# EAGLE design jaluino_bee (EAGLE 5.11)
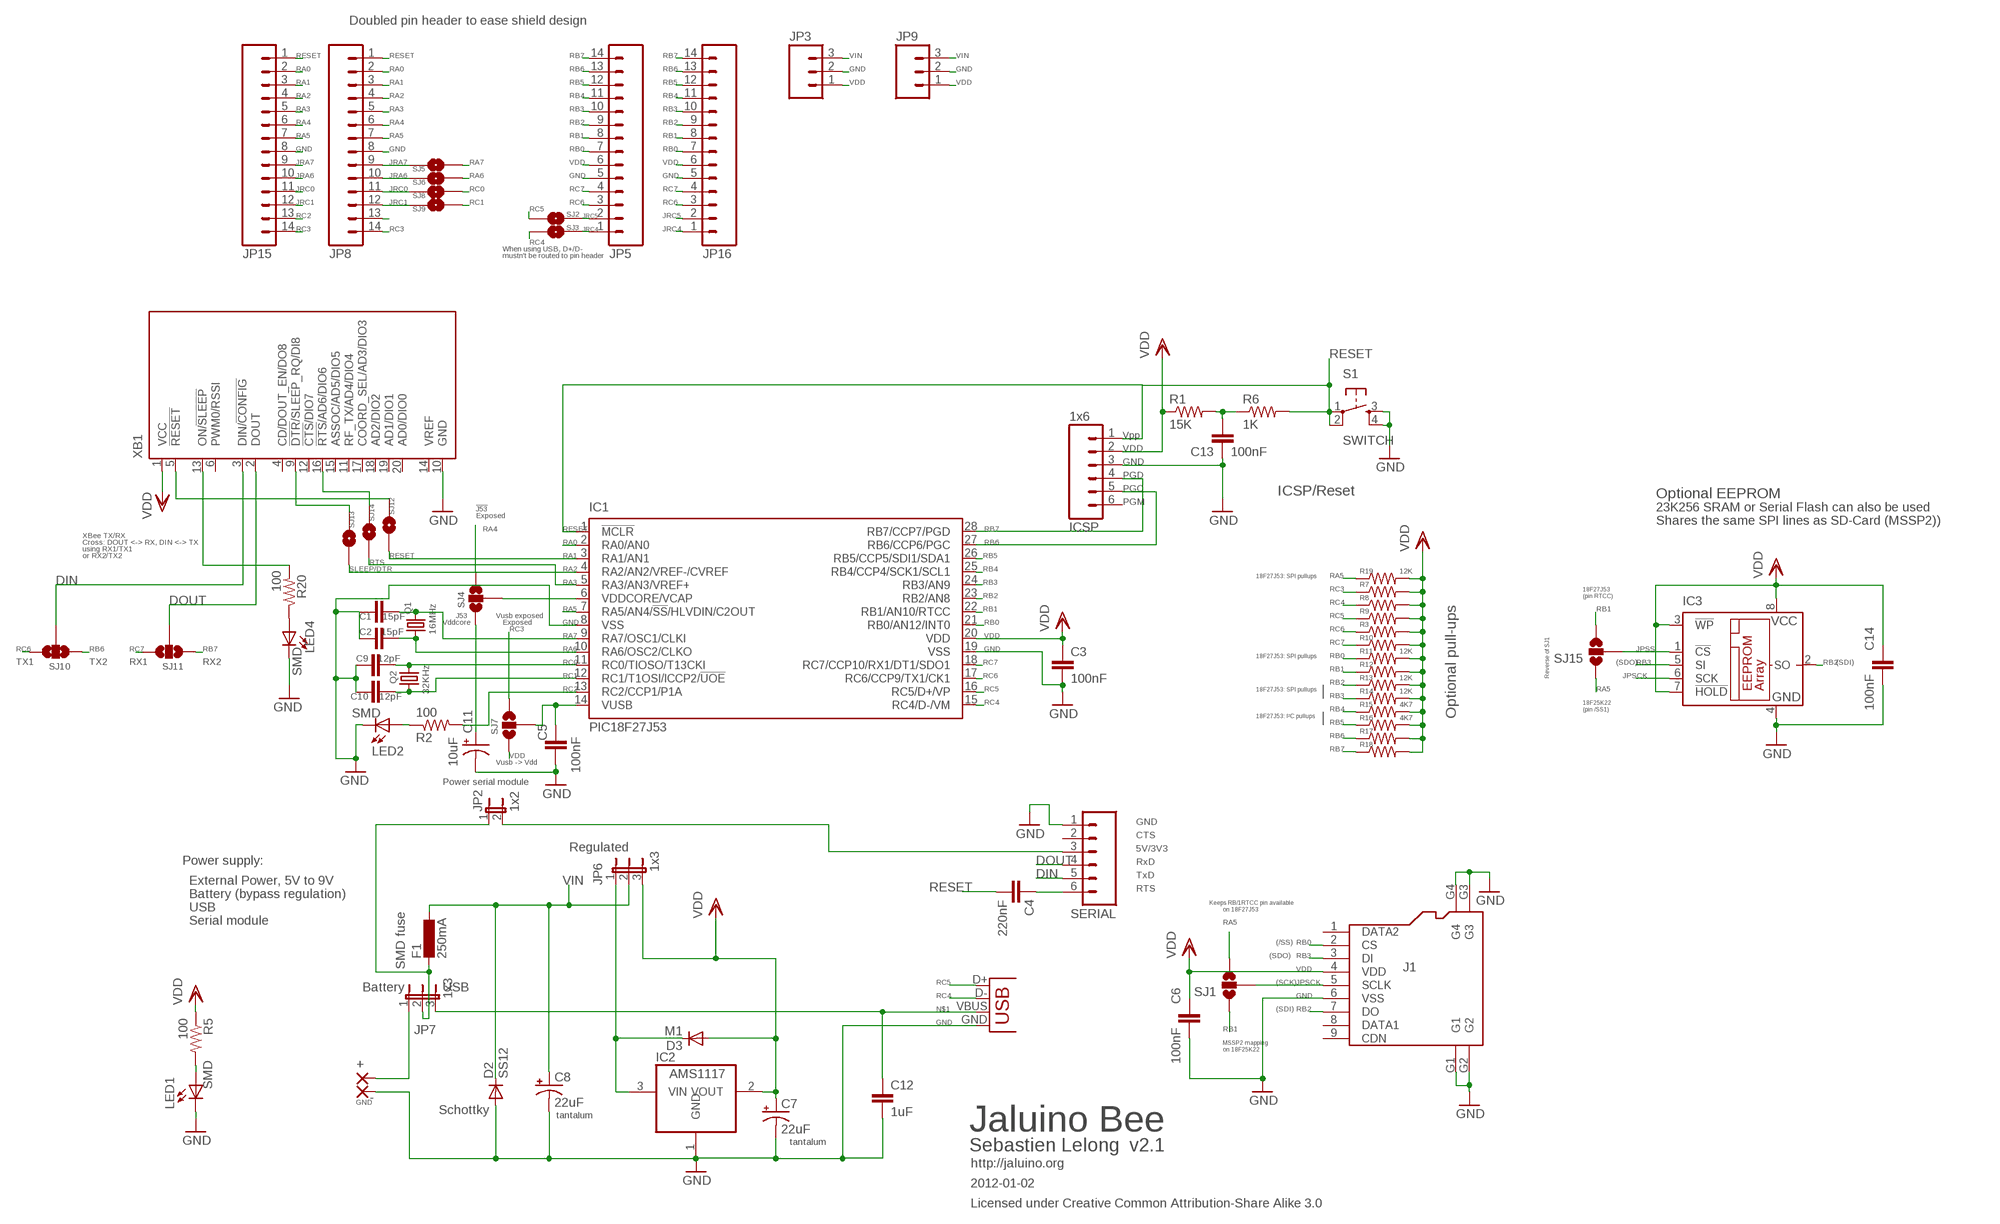
[diagram p0: schematic, sheet 1]

## Parts
+  2,54/1,0  [2,54/1,0]
-  2,54/1,0  [2,54/1,0]
C1  15pF  CAP1206  [1206]
C2  15pF  CAP1206  [1206]
C3  100nF  CAP1206  [1206]
C4  220nF  CAP1206  [1206]
C5  100nF  CAP1206  [1206]
C6  100nF  CAP1206  [1206]
C7  22uF  CAP_POL3528  [EIA3528]
C8  22uF  CAP_POL3528  [EIA3528]
C9  12pF  CAP1206  [1206]
C10  12pF  CAP1206  [1206]
C11  10uF  CAP_POL3528  [EIA3528]
C12  1uF  CAP1206  [1206]
C13  100nF  CAP1206  [1206]
C14  100nF  CAP1206  [1206]
D2  SS12  DIODESMA  [SMA-DIODE]
D3  M1  DIODE-DO-214AC  [DO-214AC]
F1  250mA  L-EUL1812  [L1812]
IC1  PIC18F27J53  PIC18F2455_28W  [SO28W]
IC2  AMS1117  REG1117  [SOT223]
IC3  25LC080SN  [SO-08]
ICSP  1x6  M06SIP  [1X06]
J1  HOLDER-MICROSD-9P  [9P-SMD-W/-RING]
JP2  1x2  JUMPER-2PTH  [1X02]
JP3  M03PTH  [1X03]
JP5  M14  [1X14]
JP6  1x3  JP2E  [JP2]
JP7  1x3  JP2E  [JP2]
JP8  M14  [1X14]
JP9  M03PTH  [1X03]
JP15  M14  [1X14]
JP16  M14  [1X14]
LED1  SMD  LED1206  [LED-1206]
LED2  SMD  LED1206  [LED-1206]
LED4  SMD  LED1206  [LED-1206]
Q1  16MHz  CRYSTALHC49S  [HC49/S]
Q2  32KHz  CRYSTALTC26H  [TC26H]
R1  15K  RESISTOR1206  [1206]
R2  100  RESISTOR1206  [1206]
R3  RESISTOR1206  [1206]
R5  100  RESISTOR1206  [1206]
R6  1K  RESISTOR1206  [1206]
R7  RESISTOR1206  [1206]
R8  RESISTOR1206  [1206]
R9  RESISTOR1206  [1206]
R10  RESISTOR1206  [1206]
R11  12K  RESISTOR1206  [1206]
R12  RESISTOR1206  [1206]
R13  12K  RESISTOR1206  [1206]
R14  12K  RESISTOR1206  [1206]
R15  4K7  RESISTOR1206  [1206]
R16  4K7  RESISTOR1206  [1206]
R17  RESISTOR1206  [1206]
R18  RESISTOR1206  [1206]
R19  12K  RESISTOR1206  [1206]
R20  100  RESISTOR1206  [1206]
S1  SWITCH  TAC_SWITCHSMD  [TACTILE_SWITCH_SMD]
SERIAL  M06SIP  [1X06]
SJ1  SOLDERJUMPER_2WAYS  [SJ_3]
SJ2  SOLDERJUMPERNO  [SJ_2S-NO]
SJ3  SOLDERJUMPERNO  [SJ_2S-NO]
SJ4  SOLDERJUMPER_2WAYS  [SJ_3]
SJ5  SOLDERJUMPERNO  [SJ_2S-NO]
SJ6  SOLDERJUMPERNO  [SJ_2S-NO]
SJ7  SOLDERJUMPER_2WAYS  [SJ_3]
SJ8  SOLDERJUMPERNO  [SJ_2S-NO]
SJ9  SOLDERJUMPERNO  [SJ_2S-NO]
SJ10  SOLDERJUMPER_2WAYS  [SJ_3]
SJ11  SOLDERJUMPER_2WAYS  [SJ_3]
SJ12  SOLDERJUMPERNO  [SJ_2S-NO]
SJ13  SOLDERJUMPERNO  [SJ_2S-NO]
SJ14  SOLDERJUMPERNO  [SJ_2S-NO]
SJ15  SOLDERJUMPER_2WAYS  [SJ_3]
X2  USB-MICROB  [USB-MICROB]
XB1  XBEE  [XBEE]

## Nets
DIN: SERIAL.5 SJ10.2 XB1.3(DIN/!CONFIG)
DOUT: SERIAL.4 SJ11.2 XB1.2(DOUT)
GND: -.1(P) C1.1 C2.1 C3.2 C5.2 C6.2 C7.C(-) C8.C(-) C9.1 C10.1 C11.C(-) C12.2 C13.2 C14.2 D2.A IC1.8(VSS) IC1.19(VSS) IC2.1(GND) IC3.4(GND) ICSP.3 J1.6(VSS) J1.G1 J1.G2 J1.G3 J1.G4 JP3.2 JP5.5 JP8.8 JP9.2 JP15.8 JP16.5 LED1.C LED2.C LED4.C S1.3 S1.4 SERIAL.1 X2.GND XB1.10(GND)
JPSCK: IC3.6(SCK) J1.5(SCLK) SJ1.2
JPSS: IC3.1(!CS) SJ15.2
JRA6: JP8.10 JP15.10 SJ6.2
JRA7: JP8.9 JP15.9 SJ5.2
JRC0: JP8.11 JP15.11 SJ8.2
JRC1: JP8.12 JP15.12 SJ9.2
JRC4: JP5.1 JP16.1 SJ3.2
JRC5: JP5.2 JP16.2 SJ2.2
N$1: C12.1 JP7.3 X2.VBUS
N$2: C4.1 SERIAL.6
N$3: IC1.6(VDDCORE/VCAP) SJ4.2
N$4: F1.2 JP2.1 JP7.2
N$5: C13.1 R1.2 R6.1
N$6: LED1.A R5.2
N$7: LED2.A R2.1
N$8: C11.A(+) SJ4.1
N$9: JP2.2 SERIAL.3
N$10: D3.C IC2.3(VIN) JP6.1
N$11: SJ12.2 XB1.5(!RESET)
N$12: C5.1 IC1.14(VUSB) SJ7.2
N$13: SJ13.2 XB1.9(!DTR!/SLEEP_RQ/DI8)
N$15: LED4.A R20.1
N$16: R20.2 XB1.13(ON/!SLEEP)
N$17: SJ14.2 XB1.16(!RTS!/AD6/DIO6)
RA0: IC1.2(RA0/AN0) JP8.2 JP15.2
RA1: IC1.3(RA1/AN1) JP8.3 JP15.3 SJ12.1
RA2: IC1.4(RA2/AN2/VREF-/CVREF) JP8.4 JP15.4 SJ13.1
RA3: IC1.5(RA3/AN3/VREF+) JP8.5 JP15.5 SJ14.1
RA4: JP8.6 JP15.6 SJ4.3
RA5: IC1.7(RA5/AN4/!SS!/HLVDIN/C2OUT) JP8.7 JP15.7 R19.1 SJ1.3 SJ15.1
RA6: C2.2 IC1.10(RA6/OSC2/CLKO) Q1.1 SJ6.1
RA7: C1.2 IC1.9(RA7/OSC1/CLKI) Q1.2 SJ5.1
RB0: IC1.21(RB0/AN12/INT0) J1.2(CS) JP5.7 JP16.7 R11.1
RB1: IC1.22(RB1/AN10/RTCC) JP5.8 JP16.8 R12.1 SJ1.1 SJ15.3
RB2: IC1.23(RB2/AN8) IC3.2(SO) J1.7(DO) JP5.9 JP16.9 R13.1
RB3: IC1.24(RB3/AN9) IC3.5(SI) J1.3(DI) JP5.10 JP16.10 R14.1
RB4: IC1.25(RB4/CCP4/SCK1/SCL1) JP5.11 JP16.11 R15.1
RB5: IC1.26(RB5/CCP5/SDI1/SDA1) JP5.12 JP16.12 R16.1
RB6: IC1.27(RB6/CCP6/PGC) ICSP.5 JP5.13 JP16.13 R17.1 SJ10.1
RB7: IC1.28(RB7/CCP7/PGD) ICSP.4 JP5.14 JP16.14 R18.1 SJ11.1
RC0: C9.2 IC1.11(RC0/TIOSO/T13CKI) Q2.2 SJ8.1
RC1: C10.2 IC1.12(RC1/T1OSI/ICCP2/!UOE) Q2.1 SJ9.1
RC2: IC1.13(RC2/CCP1/P1A) JP8.13 JP15.13 R2.2
RC3: JP8.14 JP15.14 R7.1 SJ7.3
RC4: IC1.15(RC4/D-/VM) R8.1 SJ3.1 X2.D-
RC5: IC1.16(RC5/D+/VP) R9.1 SJ2.1 X2.D+
RC6: IC1.17(RC6/CCP9/TX1/CK1) JP5.3 JP16.3 R3.1 SJ10.3
RC7: IC1.18(RC7/CCP10/RX1/DT1/SDO1) JP5.4 JP16.4 R10.1 SJ11.3
RESET: C4.2 IC1.1(!MCLR!) ICSP.1 JP8.1 JP15.1 R6.2 S1.1 S1.2
VDD: C3.1 C6.1 C7.A(+) C14.1 D3.A IC1.20(VDD) IC2.2(VOUT) IC3.3(!WP) IC3.7(!HOLD) IC3.8(VCC) ICSP.2 J1.4(VDD) JP3.1 JP5.6 JP6.3 JP9.1 JP16.6 R1.1 R3.2 R5.1 R7.2 R8.2 R9.2 R10.2 R11.2 R12.2 R13.2 R14.2 R15.2 R16.2 R17.2 R18.2 R19.2 SJ7.1 XB1.1(VCC)
VIN: +.1(P) C8.A(+) D2.C F1.1 JP3.3 JP6.2 JP7.1 JP9.3
Unconnected: ICSP.6 J1.1(DATA2) J1.8(DATA1) J1.9(CDN) SERIAL.2 XB1.4(CD/DOUT_EN/DO8) XB1.6(PWM0/RSSI) XB1.11(RF_TX/AD4/DIO4) XB1.12(!CTS!/DIO7) XB1.14(VREF) XB1.15(ASSOC/AD5/DIO5) XB1.17(COORD_SEL/AD3/DIO3) XB1.18(AD2/DIO2) XB1.19(AD1/DIO1) XB1.20(AD0/DIO0)

## Notes on the sheet
- Doubled pin header to ease shield design
- When using USB, D+/D-
- mustn't be routed to pin header
- Vpp
- VDD
- GND
- PGD
- PGC
- ICSP/Reset | Optional EEPROM
- PGM
- !J53 | 23K256 SRAM or Serial Flash can also be used
- Exposed
- Shares the same SPI lines as SD-Card (MSSP2))
- XBee TX/RX
- Cross: DOUT <-> RX, DIN <-> TX
- using RX1/TX1
- or RX2/TX2 | RESET
- RTS
- SLEEP/DTR
- 18F27J53: SPI pullups
- 18F27J53
- (pin RTCC)
- J53 | Vusb exposed
- Vddcore | Exposed
- 18F27J53: SPI pullups
- TX1 | TX2 | RX1 | RX2 | (SDO) | (SDI)
- Reverse of SJ1
- 18F27J53: SPI pullups
- 18F25K22
- (pin /SS1)
- 18F27J53: I²C pullups | Optional pull-ups
- Vusb -> Vdd
- Power serial module
- GND
- CTS
- Regulated | 5V/3V3
- Power supply: | RxD
- TxD
- External Power, 5V to 9V
- RTS
- Battery (bypass regulation)
- Keeps RB/1RTCC pin available
- USB | SMD fuse | on 18F27J53
- Serial module
- (/SS)
- (SDO)
- (SCK)
- Battery | USB
- (SDI)
- MSSP2 mapping
- on 18F25K22
- GND | Schottky
- tantalum
- Jaluino Bee
- tantalum
- Sebastien Lelong | v2.1
- http://jaluino.org
- 2012-01-02
- Licensed under Creative Common Attribution-Share Alike 3.0

## Library data of the parts
+ - = wirepad:2,54/1,0: THROUGH-HOLE PAD
C1-C6 C9 C10 C12-C14 = SparkFun:CAP: Capacitor Standard 0603 ceramic capacitor, and 0.1" leaded capacitor.
C7 C8 C11 = SparkFun:CAP_POL: Capacitor Polarized These are standard SMD and PTH capacitors. Normally 10uF, 47uF, and 100uF in electrolytic and tantalum varieties. Always verify the external diameter of the through hole cap, it varies with capacity, voltage, and manufacturer. The EIA devices should be standard.
D2 = SparkFun:DIODE: Diode These are standard reverse protection diodes and small signal diodes. SMA package can handle up to about 1A. SOD-323 can handle about 200mA. What the SOD-323 package when ordering, there are some mfgs out there that are 5-pin packages.
D3 = diode:DIODE-: DIODE
F1 = rcl:L-EU: INDUCTOR, European symbol
IC1 = microchip:PIC18F2*_28: USB Microcontrollers with nanoWatt Technology High-Performance, Enhanced Flash, 28/40/44-Pin, Source: http://ww1.microchip.com/downloads/en/devicedoc/39632c.pdf
IC2 = burr-brown:REG1117: 800mA and 1A Low Dropout (LDO) Positive Regulator 1.8V, 2.5V, 2.85V, 3.3V, 5V, and Adj
IC3 = microchip:25*: Serial EEPROM 4 K, SPI bus
ICSP SERIAL = SparkFun:M06: Header 6 Standard 6-pin 0.1" header. Use with straight break away headers (SKU : PRT-00116), right angle break away headers (PRT-00553), swiss pins (PRT-00743), machine pins (PRT-00117), and female headers (PRT-00115). Molex polarized connector foot print use with SKU : PRT-08094 with associated crimp pins and housings. NOTES ON THE VARIANTS LOCK and LOCK_LONGPADS... This footprint was designed to help hold the alignment of a through-hole component (i.e. 6-pin header) while soldering it into place. You may notice that each hole has been shifted either up or down by 0.005 of an inch from it's more standard position (which is a perfectly straight line). This slight alteration caused the pins (the squares in the middle) to touch the edges of the holes. Because they are alternating, it causes a "brace" to hold the component in place. 0.005 has proven to be the perfect amount of "off-center" position when using our standard breakaway headers. Although looks a little odd when you look at the bare footprint, once you have a header in there, the alteration is very hard to notice. Also, if you push a header all the way into place, it is covered up entirely on the bottom side. This idea of altering the position of holes to aid alignment will be further integrated into the Sparkfun Library for other footprints. It can help hold any component with 3 or more connection pins.
J1 = Connector:HOLDER-MICROSD-9P
JP2 = SparkFun:JUMPER-2: Jumper Basic 0.1" spaced jumper. Use with breakaway headers.
JP3 JP9 = SparkFun:M03: Header 3 Standard 3-pin 0.1" header. Use with straight break away headers (SKU : PRT-00116), right angle break away headers (PRT-00553), swiss pins (PRT-00743), machine pins (PRT-00117), and female headers (PRT-00115). Molex polarized connector foot print use with SKU : PRT-08232 with associated crimp pins and housings.
JP5 JP8 JP15 JP16 = SparkFun:M14: Header 14 Standard 14-pin 0.1" header. Use with straight break away headers (SKU : PRT-00116), right angle break away headers (PRT-00553), swiss pins (PRT-00743), machine pins (PRT-00117), and female headers (PRT-00115).
JP6 JP7 = jumper:JP2E: JUMPER
LED1 LED2 LED4 = SparkFun:LED: LEDs Standard schematic elements and footprints for 5mm, 3mm, 1206, and 0603 sized LEDs. 5mm - Spark Fun Electronics SKU : COM-00529 (and others)
Q1 Q2 = crystal:CRYSTAL: CRYSTAL
R1-R3 R5-R20 = SparkFun:RESISTOR: Resistor Basic schematic elements and footprints for 0603, 1206, and PTH resistors.
S1 = SparkFun:TAC_SWITCH: Momentary Switch Button commonly used for reset or general input. Spark Fun Electronics SKU : COM-00097
SJ1 SJ4 SJ7 SJ10 SJ11 SJ15 = SparkFun:SOLDERJUMPER_2WAY: Solder Jumper 2 way solder jumper
SJ2 SJ3 SJ5 SJ6 SJ8 SJ9 SJ12-SJ14 = SparkFun:SOLDERJUMPER: Solder Jumper Standard SMD solder jumper. Used to automate production. Two varients : Normally Open and Normally Closed are the same, but have different paste layers. NC will have a large amount of paste and should jumper during reflow.
X2 = SparkFun:USB: USB Connectors USB-B-PTH is fully proven SKU : PRT-00139 USB-miniB is fully proven SKU : PRT-00587 USB-A-PCB is untested. USB-A-H is throughly reviewed, but untested. Spark Fun Electronics SKU : PRT-00437 USB-B-SMT is throughly reviewed, but untested. Needs silkscreen touching up. USB-A-S has not been used/tested USB-MB-H has not been used/tested
XB1 = maxstream:XBEE: XBee (TM) /XBee-PRO(TM) OEM RF Modules Source: MaxStream, Inc. xbee_productmanual.pdf

## Board
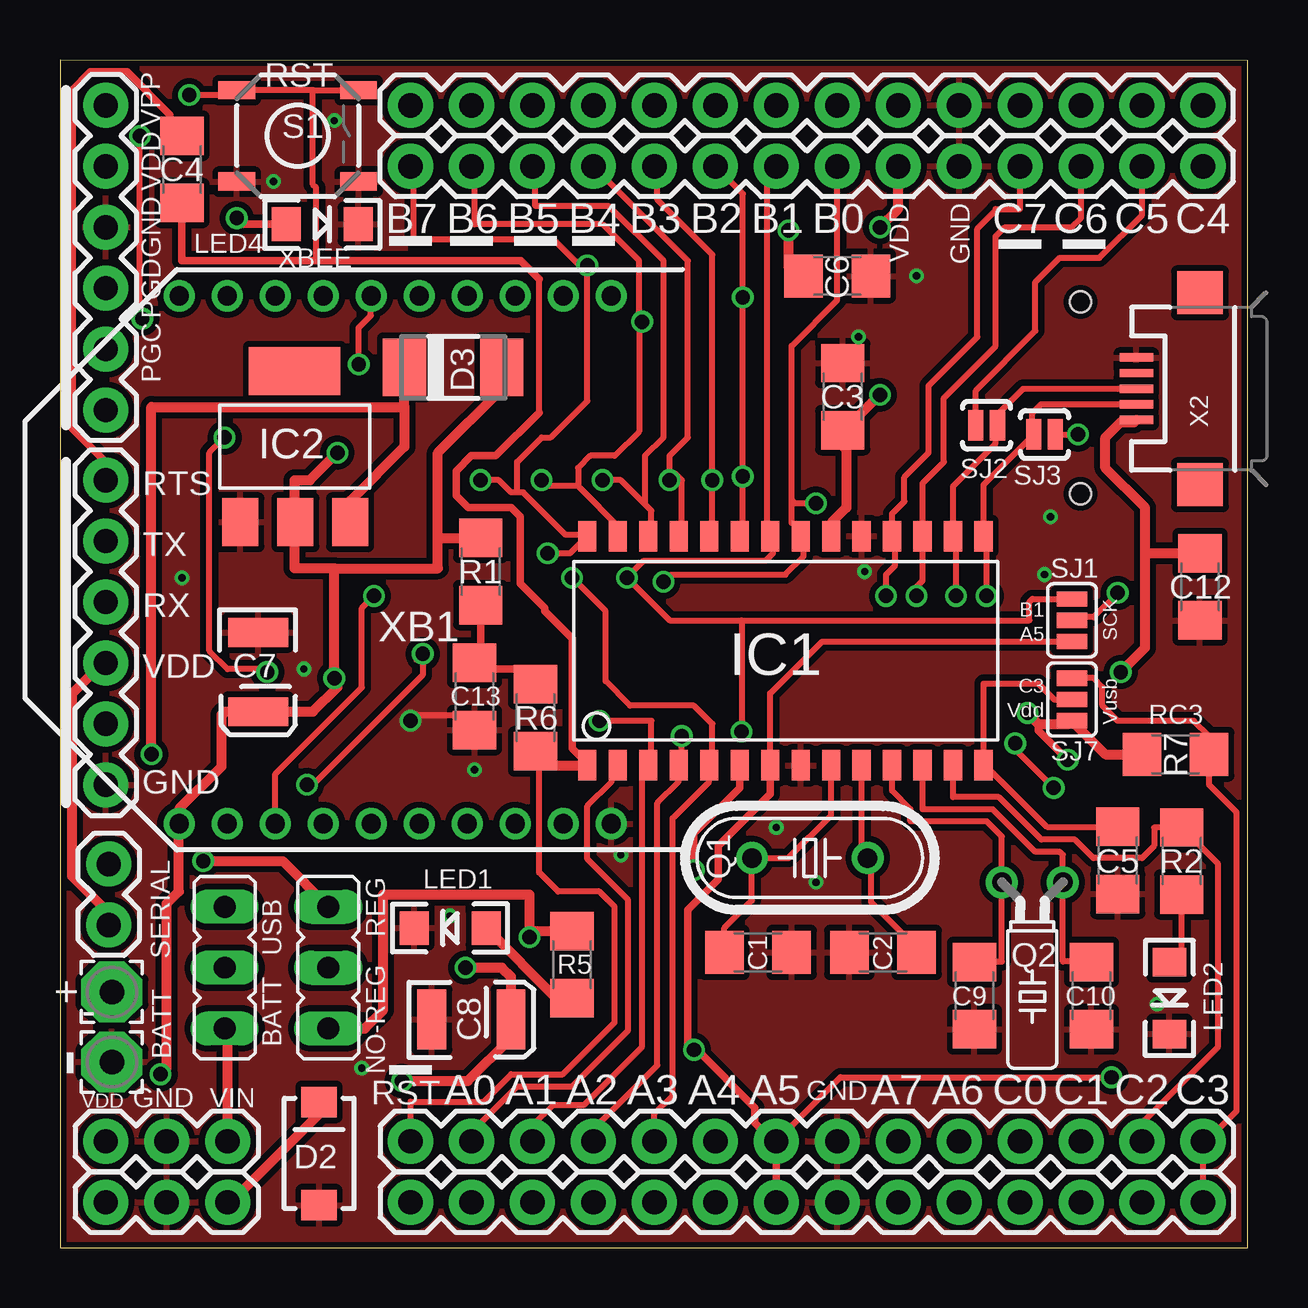
[diagram p1: board, top side]
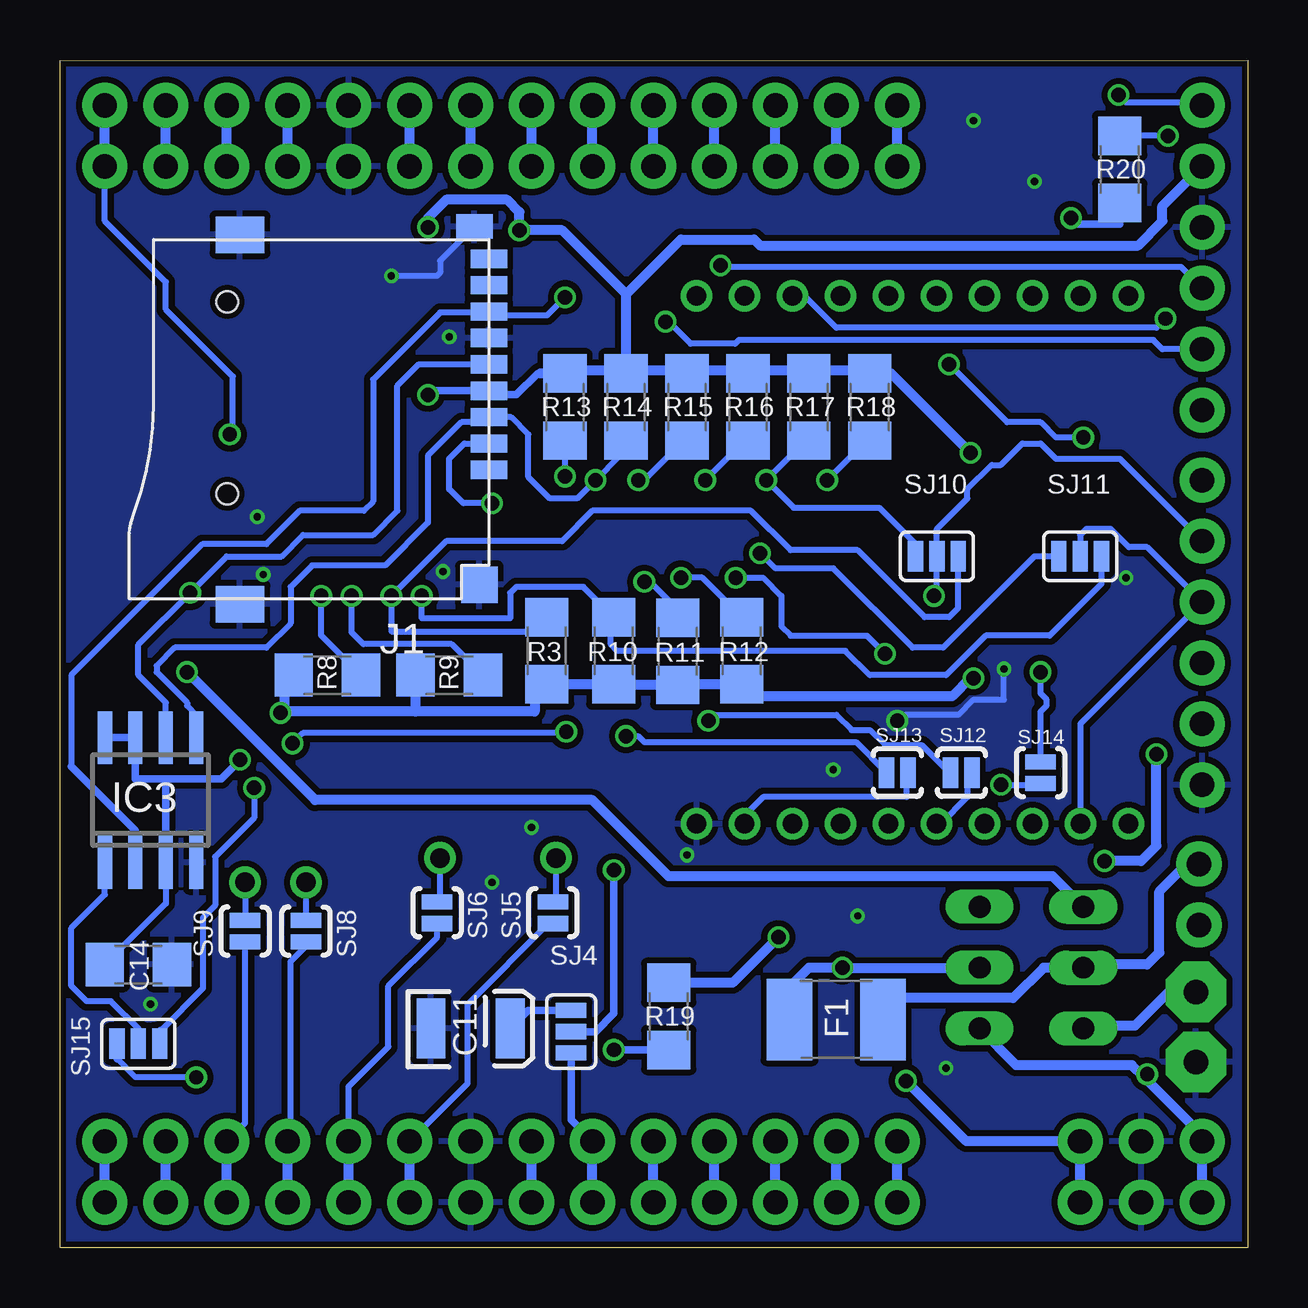
[diagram p2: board, bottom side, seen from below]

Size 49.49 x 49.52 mm. Coordinates in mm from the lower left corner, seen from the top.
Outline: 0,0 49.49,0 49.49,49.49 0,49.52 0,0
Copper layers (1*16): Top 0.035mm / dielectric 1.5mm / Bottom 0.035mm
Design rules "bee_seeed": minimum track width 6mil, minimum drill 12mil, track to track 6mil, track to pad 6mil, pad to pad 6mil, via to via 6mil, smd to smd 0mil, copper to edge 10mil, drill to drill 10mil, minimum pad ring 10mil, minimum via ring 6mil, stop-mask expansion 2mil, vias tented up to drill 100mil, thermal gap 10mil

### Footprints (pad centres in the part's own frame; a part is rotated, then mirrored left to right if it is on the bottom)
2,54/1,0 = drill 1.016 pad 2.54 octagon: 1 0,0
1206 = smd 1.6 x 1.8: 1 -1.4,0; 2 1.4,0
EIA3528 = smd 1.2 x 2.5: A 1.65,0; C -1.65,0
SMA-DIODE = smd 1.27 x 1.47: A -2.15,0; C 2.15,0
DO-214AC = smd 1.8 x 2.4: A 2.025,0; C -2.025,0
L1812 = smd 1.9 x 3.4: 1 -1.95,0; 2 1.95,0
SO28W = smd 0.762 x 1.27: 1 -7.62,-4.78; 2 -6.35,-4.78; 3 -5.08,-4.78; 4 -3.81,-4.78; 5 -2.54,-4.78; 6 -1.27,-4.78; 7 0,-4.78; 8 1.27,-4.78; 9 2.54,-4.78; 10 3.81,-4.78; 11 5.08,-4.78; 12 6.35,-4.78; 13 7.62,-4.78; 14 8.89,-4.78; 15 8.89,4.78; 16 7.62,4.78; 17 6.35,4.78; 18 5.08,4.78; 19 3.81,4.78; 20 2.54,4.78; 21 1.27,4.78; 22 0,4.78; 23 -1.27,4.78; 24 -2.54,4.78; 25 -3.81,4.78; 26 -5.08,4.78; 27 -6.35,4.78; 28 -7.62,4.78
SOT223 = smd 1.499 x 2.007: 1 -2.261,-3.15; 2 0.025,-3.15; 3 2.311,-3.15 | smd 3.81 x 2.007: 4 0,3.15
SO-08 = smd 0.6 x 2.2: 1 -1.905,-2.6; 2 -0.635,-2.6; 3 0.635,-2.6; 4 1.905,-2.6; 5 1.905,2.6; 6 0.635,2.6; 7 -0.635,2.6; 8 -1.905,2.6
1X06 = drill 1.016 pad 1.88 round: 1 0,0; 2 2.54,0; 3 5.08,0; 4 7.62,0; 5 10.16,0; 6 12.7,0
9P-SMD-W/-RING = smd 1.524 x 0.762: 1 0,4.4; 2 0,3.3; 3 0,2.2; 4 0,1.1; 5 0,0; 6 0,-1.1; 7 0,-2.2; 8 0,-3.3; 9 0,-4.4 | smd 1.524 x 1.016: G1 0.6,-5.746 | smd 2.032 x 1.524: G2 10.373,-5.4; G3 10.373,10 | smd 1.524 x 1.524: G4 0.392,9.181 | hole 0.889: 10.9,-2.6; 10.9,5.4
1X02 = drill 1.016 pad 1.88 round: 1 0,0; 2 2.54,0
1X03 = drill 1.016 pad 1.88 round: 1 0,0; 2 2.54,0; 3 5.08,0
1X14 = drill 1.016 pad 1.88 round: 1 0,0; 2 2.54,0; 3 5.08,0; 4 7.62,0; 5 10.16,0; 6 12.7,0; 7 15.24,0; 8 17.78,0; 9 20.32,0; 10 22.86,0; 11 25.4,0; 12 27.94,0; 13 30.48,0; 14 33.02,0
JP2 = drill 0.914 long: 1 -2.54,0; 2 0,0; 3 2.54,0
LED-1206 = smd 1.2 x 1.4: A -1.5,0; C 1.5,0
HC49/S = drill 0.813 round: 1 -2.413,0; 2 2.413,0
TC26H = drill 0.813 round: 1 -1.27,0; 2 1.27,0
TACTILE_SWITCH_SMD = smd 1.524 x 0.762: 1 -2.54,1.905; 2 2.54,1.905; 3 -2.54,-1.905; 4 2.54,-1.905
SJ_3 = smd 0.635 x 1.27: 1 -0.889,0; 2 0,0; 3 0.889,0
SJ_2S-NO = smd 0.635 x 1.27: 1 -0.45,0; 2 0.45,0
USB-MICROB = smd 0.35 x 1.4: D+ 0,2.65; D- -0.65,2.65; GND 1.3,2.65; ID 0.65,2.65; VBUS -1.3,2.65 | smd 1.8 x 1.9: MT1 -4,0; MT2 4,0
XBEE = drill 0.8 pad 1.27 round: 1 -11,9; 2 -11,7; 3 -11,5; 4 -11,3; 5 -11,1; 6 -11,-1; 7 -11,-3; 8 -11,-5; 9 -11,-7; 10 -11,-9; 11 11,-9; 12 11,-7; 13 11,-5; 14 11,-3; 15 11,-1; 16 11,1; 17 11,3; 18 11,5; 19 11,7; 20 11,9

### Placement (x,y rotation side)
+  2.16,10.67 0 top
-  2.16,7.75 0 top
C1  29.08,12.32 180 top
C2  34.29,12.32 0 top
C3  32.61,35.48 90 top
C4  5.08,44.96 270 top
C5  44.07,16.15 270 top
C6  32.38,40.51 0 top
C7  8.26,24 270 top
C8  17.14,9.53 0 top
C9  38.1,10.52 90 top
C10  42.98,10.52 90 top
C11  32.38,9.14 0 bottom
C12  47.5,27.56 270 top
C13  17.27,22.99 270 top
C14  46.23,11.81 0 bottom
D2  10.79,3.94 90 top
D3  16.38,36.7 0 top
F1  17.14,9.53 0 bottom
IC1  29.59,24.89 0 top
IC2  9.78,33.4 0 top
IC3  45.72,18.67 0 bottom
ICSP  1.91,47.62 270 top
J1  31.62,36.83 180 bottom
JP2  2.03,16 270 top
JP3  1.91,1.91 0 top
JP5  47.62,45.09 180 top
JP6  11.18,11.68 270 top
JP7  6.86,11.68 90 top
JP8  14.61,1.91 0 top
JP9  1.91,4.45 0 top
JP15  14.61,4.45 0 top
JP16  47.62,47.62 180 top
LED1  16.26,13.34 180 top
LED2  46.23,10.41 270 top
LED4  10.92,42.67 0 top
Q1  31.24,16.26 180 top
Q2  40.51,15.24 180 top
R1  17.53,28.19 270 top
R2  46.74,16.13 90 top
R3  29.21,24.89 270 bottom
R5  21.34,11.81 270 top
R6  19.81,22.1 270 top
R7  46.48,20.57 180 top
R8  38.35,23.88 180 bottom
R9  33.27,23.88 180 bottom
R10  26.42,24.89 270 bottom
R11  23.75,24.87 270 bottom
R12  21.08,24.89 270 bottom
R13  28.45,35.05 90 bottom
R14  25.91,35.05 90 bottom
R15  23.37,35.05 90 bottom
R16  20.83,35.05 90 bottom
R17  18.29,35.05 90 bottom
R18  15.75,35.05 90 bottom
R19  24.13,9.65 90 bottom
R20  5.33,44.96 90 bottom
S1  9.91,46.35 0 top
SERIAL  1.91,19.3 90 top
SJ1  42.16,26.16 270 top
SJ2  38.61,34.29 180 top
SJ3  41.02,33.91 0 top
SJ4  28.19,9.02 270 bottom
SJ5  28.96,13.97 270 bottom
SJ6  33.78,13.97 270 bottom
SJ7  42.16,22.86 90 top
SJ8  39.24,13.21 270 bottom
SJ9  41.78,13.21 270 bottom
SJ10  12.95,28.83 0 bottom
SJ11  6.99,28.83 0 bottom
SJ12  11.94,19.81 0 bottom
SJ13  14.61,19.81 0 bottom
SJ14  8.64,19.81 90 bottom
SJ15  46.23,8.51 0 bottom
X2  47.5,35.81 90 top
XB1  13.97,28.68 90 top

### Tracks (layer width: path | path; a pad name or v marks a point on that pad's centre or on a via)
DIN  (via drill 0.6)
  Top 0.254: v13.08,27.18 12.57,26.67 12.57,23.37 8.97,19.77 XB1.3
  Bottom 0.254: SERIAL.5 5.33,32.89 8,32.89 8.64,33.53 9.4,33.53 10.29,32.64 10.67,32.64 11.68,31.62 11.68,31.24 12.95,29.97 SJ10.2 12.95,27.3 v13.08,27.18
DOUT
  Bottom 0.254: SJ11.2 6.99,29.72 6.73,29.97 5.71,29.97 4.95,29.21 4.19,29.21 SERIAL.4 6.97,21.86 XB1.2
GND  (via drill 0.3, 0.6)
  Top 0.254: v14.61,21.97 14.86,22.23 16.63,22.23 C13.2
  Bottom 0.254: v10.16,24.13 10.16,22.86 11.43,22.86 12.06,22.23 14.35,22.23 v14.61,21.97 | J1.G1 33.66,41.15 33.66,40.64 C6.2 v35.69,40.51
  other vias: 41.27,30.48 8.89,44.45 45.72,10.16 11.43,46.99 41.02,28.07 33.53,28.19 33.27,37.97 31.5,15.24 23.37,16.38 16.26,13.84 12.57,7.49 5.08,27.94 17.27,19.94 29.84,17.53
  pour Top (isolate 0.254): 0,49.53 49.53,49.53 49.53,0 0,0
  pour Bottom (isolate 0.254): 0,49.53 49.53,49.53 49.53,0 0,0
JPSCK  (via drill 0.6)
  Top 0.254: SJ1.2 42.29,26.29 43.05,26.29 v44.07,27.3
  Bottom 0.254: IC3.6 45.09,22.73 46.23,23.88 46.23,25.15 v44.07,27.3 42.55,28.83 40.26,28.83 39.37,29.72 36.45,29.72 35.43,30.73 35.43,35.94 34.54,36.83 J1.5
JPSS
  Bottom 0.254: SJ15.2 46.23,9.14 47.37,10.29 48.39,10.29 49.02,10.92 49.02,13.34 47.62,14.73 IC3.1
JRA6
  Bottom 0.254: JP8.10 37.47,6.73 35.81,8.38 35.81,10.92 33.78,12.95 SJ6.2
  Bottom 0.406: JP8.10 JP15.10
JRA7
  Bottom 0.254: SJ5.2 29.15,13.52 32.51,10.16 32.51,6.86 JP15.9
  Bottom 0.406: JP8.9 JP15.9
JRC0
  Bottom 0.254: SJ8.2 39.24,12.57 39.88,11.94 39.88,4.57 JP15.11
  Bottom 0.406: JP8.11 JP15.11
JRC1
  Bottom 0.254: SJ9.2 41.78,5.21 JP15.12
  Bottom 0.406: JP8.12 JP15.12
JRC4  (via drill 0.6)
  Top 0.254: SJ3.2 v42.42,33.91
  Bottom 0.254: JP5.1 47.62,42.8 45.09,40.26 45.09,39.12 42.29,36.32 42.29,34.04 v42.42,33.91
  Bottom 0.406: JP5.1 JP16.1
JRC5
  Top 0.254: SJ2.2 38.16,35.74 40.64,38.23 40.64,40.26 41.66,41.27 43.31,41.27 45.09,43.05 JP5.2
  Bottom 0.406: JP5.2 JP16.2
N$1  (via drill 0.6)
  Top 0.406: v44.2,24 45.21,25.02 45.21,28.96 | 45.21,28.96 45.21,30.86 43.56,32.51 43.56,33.78 44.2,34.42 44.75,34.42 X2.VBUS | 45.21,28.96 C12.1
  Bottom 0.406: JP7.3 8.13,15.49 24.13,15.49 27.3,18.67 38.86,18.67 v44.2,24
N$2
  Top 0.305: SERIAL.6 1.91,32.77 0.51,34.16 0.51,48.26 1.27,49.02 2.79,49.02 4.57,47.24 4.57,46.23 5.33,46.23 C4.1
N$3  (via drill 0.6)
  Top 0.305: IC1.6 28.32,19.18 26.42,17.27 v26.42,15.75
  Bottom 0.305: v26.42,15.75 26.42,9.78 27.18,9.02 SJ4.2
N$4
  Bottom 0.406: JP2.1 2.54,16 3.68,14.86 3.68,12.32 4.19,11.81 6.73,11.81 JP7.2 8.51,11.68 9.78,10.41 14.31,10.41 F1.2
N$5
  Top 0.305: R6.1 19.81,23.62 19.3,24.13 17.53,24.13 C13.1 17.53,24.64 R1.2
N$6
  Top 0.406: R5.2 20.68,10.41 LED1.A
N$7
  Top 0.254: R2.1 46.74,11.94 46.23,11.94 LED2.A
N$8
  Bottom 0.305: SJ4.1 29.97,9.91 C11.A
N$9
  Top 0.406: JP2.2 2.03,13.97 0.51,15.49 0.51,23.11 1.78,24.38 SERIAL.3
N$10  (via drill 0.6)
  Top 0.406: 12.06,31.11 12.06,30.35 IC2.3 12.09,31.14 14.35,33.4 14.35,35.05 | v3.81,20.57 3.81,35.05 14.35,35.05 | v5.97,16.13 9.27,16.13 JP6.1 | 14.35,35.05 D3.C
  Bottom 0.406: v3.81,20.57 3.81,16.76 4.45,16.13 v5.97,16.13
N$11
  Bottom 0.254: SJ12.2 11.68,19.62 11.68,18.8 12.8,17.68 XB1.5
N$12
  Top 0.254: SJ7.2 41.43,22.86 40.77,23.52 38.48,23.52 IC1.14 38.56,20.11 41.12,17.55 C5.1
N$13
  Bottom 0.254: SJ13.2 14.22,19.74 14.22,18.8 20.19,18.8 20.97,18.02 XB1.9
N$15  (via drill 0.6)
  Top 0.305: v7.37,42.93 7.62,42.67 LED4.A
  Bottom 0.305: v7.37,42.93 7.11,42.67 5.33,42.67 R20.1
N$16  (via drill 0.6)
  Top 0.254: v3.43,38.73 3.33,38.84 v3.33,46.35 3.43,46.35 3.45,46.33
  Bottom 0.254: v3.33,46.35 R20.2 | v3.43,38.73 3.81,38.35 17.14,38.35 18.41,39.62 18.91,39.62 XB1.13
N$17  (via drill 0.6)
  Top 0.254: v12.45,36.83 12.45,38.35 12.95,38.86 12.95,39.67 XB1.16 | v8.64,24 8.51,24.13 6.99,24.13 6.22,24.89 6.22,33.15 v6.86,33.78
  Bottom 0.254: v12.45,36.83 10.03,34.42 8.64,34.42 8,33.78 v6.86,33.78 | v8.64,24 8.64,23.11 8.38,22.86 8.38,22.61 8.64,22.35 SJ14.2
RA0
  Top 0.254: JP15.2 17.14,4.83 19.05,6.73 21.34,6.73 23.67,9.07 23.67,14.5 21.97,16.2 21.97,18.41 22.99,19.43 22.99,19.86 23.24,19.86 IC1.2
  Bottom 0.406: JP8.2 JP15.2
RA1  (via drill 0.6)
  Top 0.254: JP15.3 19.68,5.08 20.57,5.97 21.84,5.97 24.26,8.38 24.26,19.6 24.51,19.6 IC1.3 24.64,20.32 24.64,21.97 v22.48,21.97
  Bottom 0.254: v22.48,21.97 22.23,22.23 17.14,22.23 16.51,21.59 15.75,21.59 15.11,20.95 13.59,20.95 12.45,19.81 SJ12.1
  Bottom 0.406: JP8.3 JP15.3
RA2  (via drill 0.6)
  Top 0.254: JP15.4 22.23,4.95 24.89,7.62 24.89,18.54 25.78,19.43 IC1.4 25.91,20.32 v25.91,21.34
  Bottom 0.254: v25.91,21.34 25.4,21.34 25.15,21.08 16.32,21.08 SJ13.1
  Bottom 0.406: JP8.4 JP15.4
RA3  (via drill 0.6)
  Top 0.254: JP15.5 24.77,5.59 25.53,6.35 25.53,17.91 27.05,19.43 IC1.5 27.18,20.32 27.18,21.84 26.42,22.61 23.75,22.61 22.73,23.62 22.73,26.54 v21.34,27.94 | 14.86,24.51 v15.11,24.77 15.11,23.88 10.54,19.3 v10.29,19.3
  Bottom 0.254: v21.34,27.94 20.19,27.94 19.43,27.18 19.43,25.91 19.05,25.53 15.88,25.53 v15.11,24.77 | SJ14.1 8.69,19.3 v10.29,19.3
  Bottom 0.406: JP8.5 JP15.5
RA4
  Bottom 0.305: SJ4.3 28.19,5.33 JP15.6
  Bottom 0.406: JP8.6 JP15.6
RA5  (via drill 0.6)
  Top 0.254: IC1.7 29.59,23.11 31.75,25.27 SJ1.3 | v43.81,7.11 32.51,7.11 JP15.7
  Top 0.305: IC1.7 29.59,18.92 27.43,16.76 27.43,15.37 26.16,14.1 26.16,8.51 v26.42,8.26 26.54,8.26 28.96,5.84 28.96,5.21 29.84,4.32 JP8.7
  Bottom 0.254: v43.81,7.11 46.35,7.11 47.12,7.87
  Bottom 0.305: v26.42,8.26 R19.1 | 47.12,7.87 SJ15.1
  Bottom 0.406: JP8.7 JP15.7
RA6
  Top 0.254: IC1.10 33.4,16.51 Q1.1 33.78,16.13 SJ6.1 35.69,12.51 C2.2
  Bottom 0.254: Q1.1 33.66,14.55 SJ6.1
RA7
  Top 0.254: IC1.9 32.13,18.03 30.35,16.26 Q1.2 28.83,14.48 27.68,13.33 C1.2
  Bottom 0.254: Q1.2 28.83,14.55 SJ5.1
RB0  (via drill 0.6)
  Top 0.254: JP5.7 32.38,39.5 30.48,37.59 30.48,31.17 | v25.15,27.76 25.45,28.07 30.23,28.07 30.99,28.83 30.99,29.46 IC1.21 30.99,29.72 30.48,30.23 30.48,31.17 | 30.48,31.17 30.61,31.04 v31.5,31.04
  Bottom 0.254: R11.1 23.75,26.62 24.89,27.76 v25.15,27.76 | v31.5,31.04 32.69,31.04 33.27,31.62 33.27,32.89 32.64,33.53 J1.2
  Bottom 0.406: JP5.7 JP16.7
RB1  (via drill 0.6)
  Top 0.254: JP5.8 29.46,44.7 29.46,29.72 IC1.22 29.72,29.46 29.72,28.96 29.41,28.65 24.33,28.65 v23.62,27.94 25.4,26.16 28.4,26.16 | SJ1.1 40.51,27.05 40.39,26.92 40.39,26.16 28.4,26.16 | v41.4,19.18 39.8,20.78 v39.8,21.03 | 28.4,26.16 v28.4,21.51
  Bottom 0.254: v39.8,21.03 39.37,21.46 28.45,21.46 v28.4,21.51 | v41.4,19.18 41.4,17.93 43.03,16.31 43.03,14.28 43.54,13.77 43.54,10.82 45.26,9.09 45.31,9.09 45.36,9.04 45.36,8.59 SJ15.3 | v23.62,27.94 22.73,27.94 R12.1
  Bottom 0.406: JP5.8 JP16.8
RB2  (via drill 0.6)
  Top 0.254: IC1.23 28.45,29.72 v28.45,32.16 v28.45,39.62 28.45,43.94 JP5.9
  Bottom 0.254: v28.45,32.16 R13.1 | v28.45,39.62 29.21,38.86 31.45,38.86 J1.7 31.66,38.99 33.66,38.99 36.45,36.2 36.45,31.11 36.83,30.73 39.5,30.73 40.89,29.34 43.56,29.34 49.02,23.88 49.02,20.07
  Bottom 0.305: 49.02,20.07 46.35,17.4 IC3.2
  Bottom 0.406: JP5.9 JP16.9
RB3  (via drill 0.6)
  Top 0.254: IC1.24 27.18,29.72 v27.18,32 27.18,41.4 24.89,43.69 24.89,44.96 JP5.10
  Bottom 0.254: R14.1 25.91,33.53 26.16,33.53 26.16,33.02 v27.18,32 27.94,31.24 29.08,31.24 29.97,32.13 29.97,33.91 30.69,34.63 J1.3 31.62,34.42 32.77,34.42 34.16,33.02 34.16,30.23 35.94,28.45 38.99,28.45 39.88,27.56 39.88,26.04 40.89,25.02 44.7,25.02 45.47,24.26 45.47,24 44.2,22.73 44.2,22.61 43.81,22.23 | 43.81,22.23 IC3.5 | 43.81,22.23 43.69,22.23
  Bottom 0.406: JP5.10 JP16.10
RB4  (via drill 0.6)
  Top 0.254: 25.91,32 25.91,29.72 IC1.25 | 25.91,32 v25.4,32 25.4,33.02 26.16,33.78 26.16,41.15 JP5.11 | 25.91,32 25.65,32.26
  Bottom 0.254: v25.4,32 25.15,32 23.62,33.53 23.37,33.53 R15.1
  Bottom 0.406: JP5.11 JP16.11
RB5  (via drill 0.6)
  Top 0.254: 24.38,30.99 24.64,30.73 24.64,29.72 IC1.26 | 24.38,30.99 23.37,32 v22.61,32 | JP5.12 19.81,44.96 19.81,43.43 22.86,43.43 25.15,41.15 25.15,33.78 24.38,33.02 24.38,30.99
  Bottom 0.254: v22.61,32 21.08,33.53 20.83,33.53 R16.1
  Bottom 0.406: JP5.12 JP16.12
RB6  (via drill 0.6)
  Top 0.254: 21.59,31.75 23.37,29.97 23.37,29.72 IC1.27 | 21.59,31.75 20.07,31.75 v20.07,32 | JP5.13 17.27,44.96 17.27,42.67 22.61,42.67 24.13,41.15 24.13,38.61 | 24.13,38.61 24.13,34.04 23.11,33.02 22.1,33.02 21.59,32.51 21.59,31.75 | v24.26,38.61 24.13,38.61
  Bottom 0.254: R17.1 18.29,33.53 18.54,33.53 v20.07,32 18.92,30.86 15.37,30.86 13.84,29.34 SJ10.1 | ICSP.5 3.56,37.47 3.94,37.85 21.21,37.85 21.36,37.69 23.22,37.69 24.13,38.61 v24.26,38.61
  Bottom 0.406: JP5.13 JP16.13
RB7  (via drill 0.6)
  Top 0.254: 19.05,31.5 18.8,31.5 18.29,32 v17.53,32 | 19.05,31.5 19.3,31.5 21.08,29.72 21.84,29.72 IC1.28 21.25,28.96 v20.32,28.96 | JP5.14 14.73,44.96 14.73,42.04 20.57,42.04 21.97,40.64 v21.97,40.96 21.97,35.31 20.45,33.78 20.07,33.78 19.05,32.77 19.05,31.5
  Bottom 0.254: v17.53,32 16,33.53 15.75,33.53 R18.1 | v21.97,40.96 21.97,40.89 2.79,40.89 ICSP.4 | SJ11.1 8.89,28.83 12.7,25.02 13.97,25.02 17.27,28.32 19.68,28.32 v20.32,28.96
  Bottom 0.406: JP5.14 JP16.14
RC0
  Top 0.254: IC1.11 34.67,19.05 35.43,18.29 35.43,17.78 38.61,17.78 39.24,17.14 Q2.2 39.24,11.94 38.1,11.94 C9.2
  Bottom 0.254: Q2.2 SJ8.1
RC1
  Top 0.254: IC1.12 35.94,18.29 38.86,18.29 40.64,16.51 41.66,16.51 41.78,16.38 Q2.1 41.78,11.94 42.93,11.94 C10.2
  Bottom 0.254: Q2.1 SJ9.1
RC2
  Top 0.254: IC1.13 37.21,18.8 39.12,18.8 40.89,17.02 42.29,17.02 43.05,16.26 45.09,16.26 45.59,16.76 45.59,17.53 R2.2 48.26,16 48.26,8.38 45.09,5.21 JP15.13
  Bottom 0.406: JP8.13 JP15.13
RC3
  Top 0.254: JP8.14 47.62,4.32 49.02,5.71 49.02,18.16 47.88,19.3 R7.1 | R7.1 47.88,21.34 47.24,21.97 44.07,21.97 43.43,22.61 43.43,23.37 43.05,23.75 SJ7.3 | R7.1
  Bottom 0.406: JP8.14 JP15.14
RC4  (via drill 0.6)
  Top 0.254: v38.61,27.18 38.61,29.46 IC1.15 38.48,31.82 SJ3.1 40.51,33.97 40.51,34.8 40.88,35.16 X2.D-
  Bottom 0.254: R8.1 38.61,25.53 v38.61,27.18
RC5  (via drill 0.6)
  Top 0.254: IC1.16 37.08,29.34 | IC1.16 37.34,29.46 v37.34,27.18 | X2.D+ 40.13,35.81 39.06,34.74 SJ2.1 38.99,34.6 38.99,33.53 37.21,31.75 IC1.16
  Bottom 0.254: v37.34,27.18 37.34,25.65 36.85,25.17 33.17,25.17 R9.1
RC6  (via drill 0.6)
  Top 0.254: JP5.3 42.55,42.93 42.16,42.55 39.37,42.55 38.99,42.16 38.99,37.59 36.83,35.43 36.83,32.77 35.94,31.88 IC1.17 35.94,27.81 35.69,27.56 v35.69,27.18
  Bottom 0.254: R3.1 29.46,25.7 35.69,25.7 v35.69,27.18 33.4,29.46 28.57,29.46 27.3,30.73 20.7,30.73 19.05,29.08 16.26,29.08 13.46,26.29 12.45,26.29 12.06,26.67 SJ10.3
  Bottom 0.406: JP5.3 JP16.3
RC7  (via drill 0.6)
  Top 0.254: JP5.4 40.01,43.31 38.99,43.31 38.99,43.26 38.23,42.49 38.23,37.97 36.2,35.94 36.2,33.15 35.18,32.13 35.18,31.11 34.67,30.61 IC1.18 34.8,29.55 34.8,28.45 34.42,28.07 v34.42,27.18
  Bottom 0.254: 26.54,26.42 R10.1 27.68,27.56 27.69,27.56 | 27.69,27.56 30.48,27.56 30.73,27.3 30.73,26.24 34.42,26.24 v34.42,27.18 | 26.54,26.42 27.69,27.56 | 26.54,26.42 26.54,25.15 26.29,24.89 16.76,24.89 15.75,23.88 12.57,23.88 10.92,25.53 8.26,25.53 6.1,27.69 SJ11.3
  Bottom 0.406: JP5.4 JP16.4
RESET  (via drill 0.6)
  Top 0.254: 10.54,48.26 S1.1 7.16,48.06 v5.38,48.06 | 10.54,48.26 S1.2 | 19.96,34.82 19.96,40.39 | JP15.1 14.61,6.1 17.65,6.1 18.8,7.24 20.95,7.24 23.11,9.4 23.11,14.22 22.48,14.86 20.75,14.86 19.96,15.65 19.96,20.07 20.19,20.32 | 10.54,48.26 10.54,44.32 10.67,44.2 10.67,41.15
  Top 0.305: IC1.1 21.84,20.32 21.34,20.83 21.34,25.4 20.19,26.54 20.19,26.67 19.18,27.69 19.18,30.48 18.8,30.86 17.02,30.86 16.51,31.37 16.51,32.38 17.14,33.02 18.16,33.02 19.96,34.82 | 19.96,40.39 19.2,41.15 10.67,41.15 5.08,41.15 C4.2
  Top 0.406: IC1.1 20.4,20.11 20.19,20.32 R6.2
  Bottom 0.254: 2.03,47.75 5.08,47.75 v5.38,48.06
  Bottom 0.305: 2.03,47.75 ICSP.1
  Bottom 0.406: JP8.1 JP15.1
VDD  (via drill 0.6)
  Top 0.254: C6.1 30.73,40.51 30.61,40.64 | 32.69,34.08 C3.1
  Top 0.305: v41.99,20.34 40.77,21.57 40.77,21.84
  Top 0.406: C3.1 32.51,33.53 32.77,33.27 32.77,30.86 32.16,30.25 32.16,29.7 IC1.20 | IC2.2 9.78,30.23 9.78,28.32 11.43,28.32 | R7.2 43.56,20.57 SJ7.1 42.04,21.84 40.77,21.84 v40.31,22.3 | D3.A 18.41,35.81 15.75,33.15 15.75,29.59 | 19.56,13.21 19.56,14.73 13.46,14.73 13.46,9.91 12.7,9.14 JP6.3 | 19.56,13.21 R5.1 | v34.16,42.55 34.92,43.31 JP5.6 | v30.35,42.42 30.35,40.89 30.61,40.64 30.86,40.77 | 19.56,13.21 v19.56,12.95 | IC2.2 9.78,30.35 | IC2.2 9.78,30.48 9.78,32 10.41,32 v11.56,33.15 | v4.19,7.24 4.45,7.49 4.45,14.35 4.95,14.86 4.95,17.67 XB1.1 4.98,18.31 6.73,20.07 6.73,22.23 6.86,22.35 8.13,22.35 C7.A 10.54,22.35 11.56,23.37 11.56,23.75 v11.43,23.75 11.43,28.32 | v34.16,35.56 32.69,34.08 | 11.43,28.32 15.75,28.32 15.75,29.59 | R1.1 15.75,29.59
  Bottom 0.254: IC3.3 45.09,14.35 C14.1 | 29.46,36.45 29.59,36.45 | 31.11,35.56 31.62,35.56 31.66,35.56
  Bottom 0.305: IC3.8 IC3.7 46.35,19.56 45.09,19.56 | 45.09,19.56 IC3.3 | v41.99,20.34 42.77,19.56 45.09,19.56 | 29.59,36.45 30.48,35.56 31.11,35.56 | v34.16,35.56 33.99,35.73 J1.4 31.62,35.56
  Bottom 0.406: JP5.6 JP16.6 | 25.91,36.58 28.45,36.58 R13.2 28.57,36.45 29.46,36.45 | 23.37,36.58 25.91,36.58 | 25.91,36.58 R14.2 25.91,39.75 | 20.83,36.58 23.37,36.58 | 23.37,36.58 R15.2 | 18.29,36.58 20.83,36.58 | 20.83,36.58 R16.2 | 18.29,36.58 15.75,36.58 R18.2 15.62,36.45 14.86,36.45 v11.56,33.15 | 18.29,36.58 R17.2 | 4.32,7.11 2.03,4.83 2.03,4.57 JP9.1 JP3.1 | 4.32,7.11 4.83,7.62 9.65,7.62 JP6.3 | ICSP.2 3.56,43.43 3.56,42.8 4.57,41.78 20.32,41.78 20.57,42.04 23.62,42.04 25.91,39.75 | 4.32,7.11 v4.19,7.24 | v11.43,23.75 11.56,23.75 12.32,22.99 21.08,22.99 R12.2 23.72,23.49 R11.2 26.39,23.47 R10.2 R3.2 29.72,23.5 29.72,22.35 34.67,22.35 | 25.91,39.75 28.57,42.42 v30.35,42.42 30.35,43.18 30.86,43.69 33.4,43.69 34.16,42.93 v34.16,42.55 | v19.56,12.95 21.46,11.05 R19.2 | 40.13,24.26 R8.2 40.13,24.25 40.13,22.35 | 34.67,23.11 34.67,24.25 R9.2 34.67,23.12 34.67,23.11 | 34.67,22.35 34.67,23.11 | 34.67,22.35 40.13,22.35 | 40.13,22.35 v40.31,22.3 | 31.11,35.56 31.58,35.56
VIN  (via drill 0.6)
  Top 0.406: 7.29,2.07 6.99,2.07 JP3.3 7.11,1.91 10.79,5.59 D2.C | v14.25,6.96 17,6.96 18.8,8.76 C8.A 18.8,9.65 18.8,11.3 18.41,11.68 v16.89,11.68 | JP9.3 6.99,9.02 JP7.1
  Bottom 0.406: JP3.3 JP9.3 11.73,4.45 v14.25,6.96 | 2.16,10.79 +.1 3.3,10.67 4.7,9.27 6.73,9.27 JP7.1 | JP6.2 v16.89,11.68 18.29,11.68 19.05,10.92 19.05,9.57 F1.1

### Text on the board
_tsilk: RST | VPP | VDD | B7 | B6 | B5 | B4 | B3 | B2 | B1 | B0 | VDD | GND | C7 | C6 | C5 | C4 | XBEE | GND | PGD | PGC | RTS | TX | B1 | SCK | RX | A5 | VDD | C3 | Vusb | Vdd | RC3 | GND | REG | SERIAL | USB | BATT | BATT | - | GND | VIN | NO-REG | GND | VDD | RST | A0 | A1 | A2 | A3 | A4 | A5 | A7 | A6 | C0 | C1 | C2 | C3
_bsilk: RB7 | RB6 | RB5 | RB4 | RB3 | RB2 | DOUT | DIN | RX1 | RX2 | TX1 | TX2 | RTS | RESET | SLEEP | RB1 | RB0 | RC7 | RC6 | RC5 | RC4 | Expose | Expose | Xtal pins | Xtal pins | RA5 | Vddcore | A4 | RB1 | RA5 | Exposed | pin /SS
210bmp: Sebastien Lelong | http://jaluino.org | 2012-01-02 | v2.1 | Jaluino group
212bmp: v2.1 | 2012-01-02 | Sebastien Lelong | http://jaluino.org